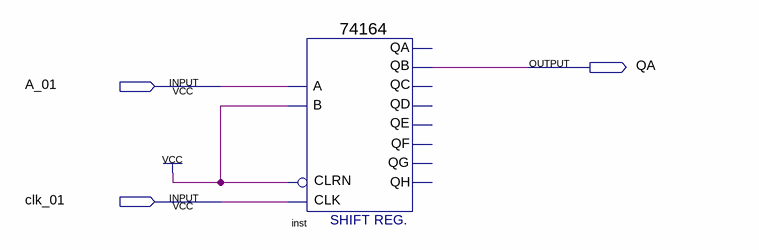
[diagram p0: schematic sheet]
// Quartus schematic jicun.bdf as structural Verilog: 1 symbols, 3 pins
module jicun (
  input  A_01,
  input  clk_01,
  output QA
);

  \74164  inst (.CLRN(1'b1), .CLK(clk_01), .B(1'b1), .A(A_01), .QB(QA));  // open: QD, QC, QA, QF, QH, QG, QE
endmodule
